# EAGLE schematic attiny_shiftOut (EAGLE 6.4)
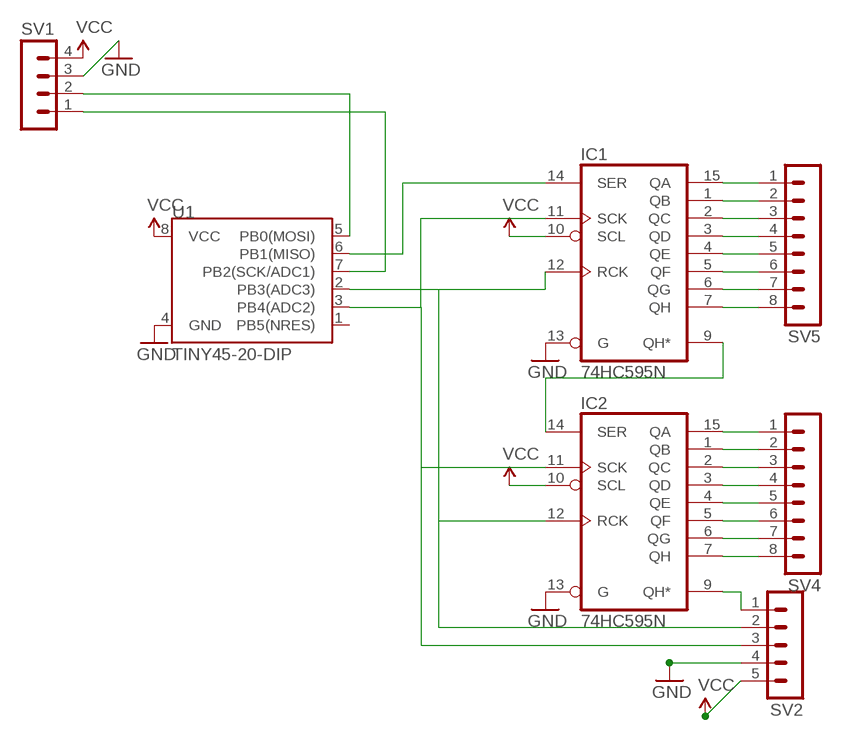
[diagram p0: schematic, sheet 1]

## Parts
IC1  74HC595N  [DIL16]
IC2  74HC595N  [DIL16]
SV1  MA04-1  [MA04-1]
SV2  MA05-1  [MA05-1]
SV4  MA08-1  [MA08-1]
SV5  MA08-1  [MA08-1]
U1  TINY45-20-DIP  ATTINY45TINY45-20-DIP  [DIP08]

## Nets
GND: IC1.13(G) IC2.13(G) SV1.3 SV2.4 U1.4(GND)
N$1: SV1.2 U1.5(PB0(MOSI))
N$2: SV1.1 U1.7(PB2(SCK/ADC1))
N$3: IC1.14(SER) U1.6(PB1(MISO))
N$4: IC1.12(RCK) IC2.12(RCK) SV2.2 U1.2(PB3(ADC3))
N$5: IC1.11(SCK) IC2.11(SCK) SV2.3 U1.3(PB4(ADC2))
N$6: IC2.15(QA) SV4.1
N$7: IC2.1(QB) SV4.2
N$8: IC2.2(QC) SV4.3
N$9: IC2.3(QD) SV4.4
N$10: IC2.4(QE) SV4.5
N$11: IC2.5(QF) SV4.6
N$12: IC2.6(QG) SV4.7
N$13: IC2.7(QH) SV4.8
N$14: IC1.15(QA) SV5.1
N$15: IC1.1(QB) SV5.2
N$16: IC1.2(QC) SV5.3
N$17: IC1.3(QD) SV5.4
N$18: IC1.4(QE) SV5.5
N$19: IC1.5(QF) SV5.6
N$20: IC1.6(QG) SV5.7
N$21: IC1.7(QH) SV5.8
N$22: IC1.9(QH*) IC2.14(SER)
N$23: IC2.9(QH*) SV2.1
VCC: IC1.10(SCL) IC2.10(SCL) SV1.4 SV2.5 U1.8(VCC)
Unconnected: U1.1(PB5(NRES))

## Power pins joined to a net without a drawn wire
GND: IC1.8(GND) IC2.8(GND)
VCC: IC1.16(VCC) IC2.16(VCC)

## Library data of the parts
IC1 IC2 = 74xx-eu:74*595: 8-bit SHIFT REGISTER, output latch
SV1 = con-lstb:MA04-1: PIN HEADER; OC_FARNELL: unknown; OC_NEWARK: unknown
SV2 = con-lstb:MA05-1: PIN HEADER; OC_FARNELL: unknown; OC_NEWARK: unknown
SV4 SV5 = con-lstb:MA08-1: PIN HEADER; OC_FARNELL: unknown; OC_NEWARK: unknown
U1 = SparkFun-DigitalIC:ATTINY45: Atmel 8-pin 2/4/8kB flash uC; PROD_ID: IC-09439